# EAGLE design picnc (EAGLE 7.4.0)
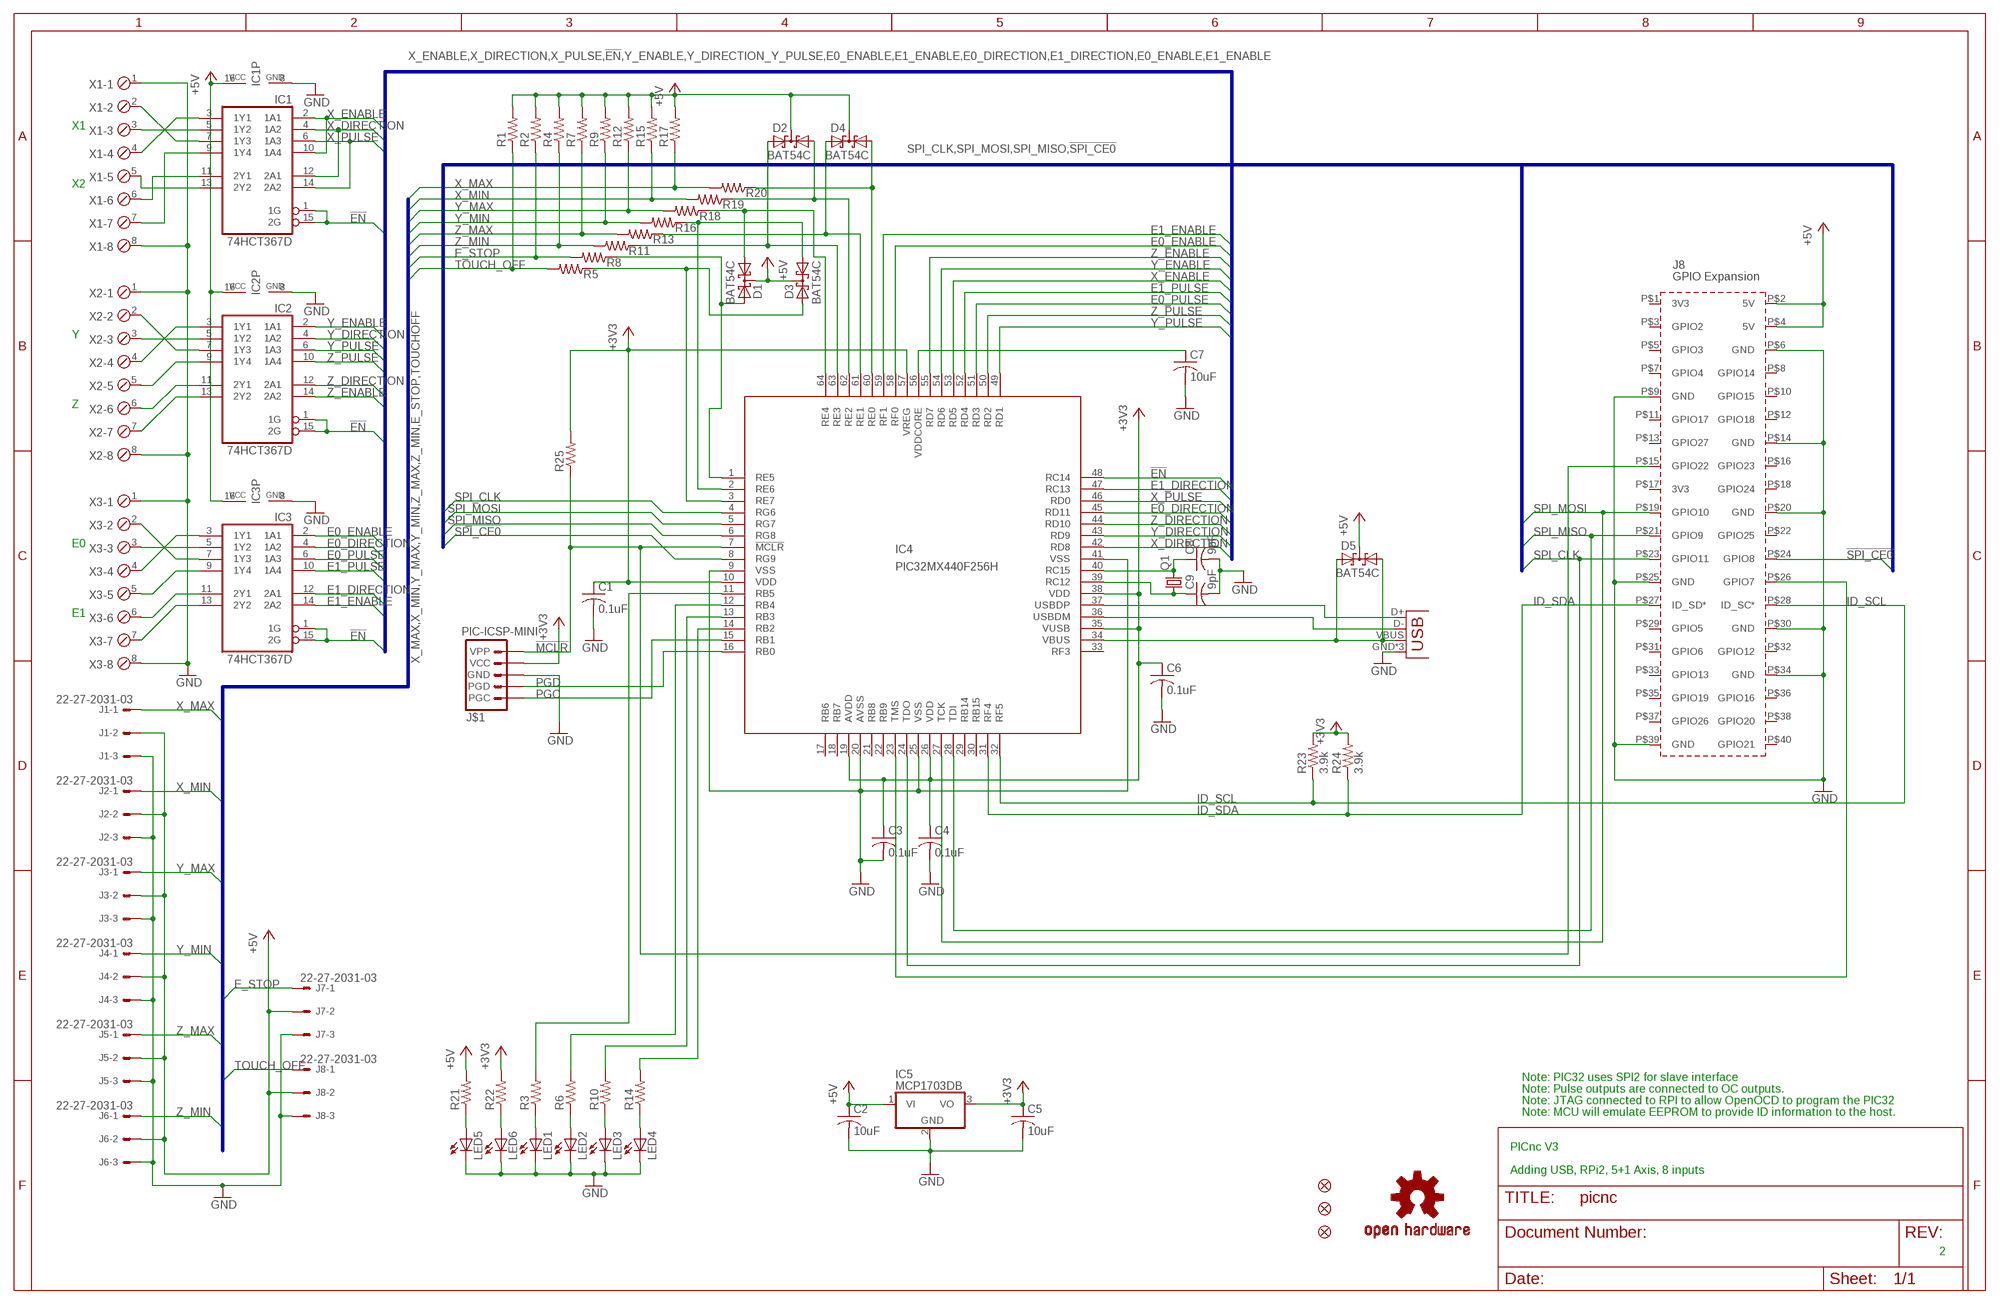
[diagram p0: schematic, sheet 1]

## Parts
C1  0.1uF  C-USC0603  [C0603]
C2  10uF  C-USC1206  [C1206]
C3  0.1uF  C-USC0603  [C0603]
C4  0.1uF  C-USC0603  [C0603]
C5  10uF  C-USC1206  [C1206]
C6  0.1uF  C-USC0603  [C0603]
C7  10uF  C-USC1206  [C1206]
C8  9pF  C-USC0603  [C0603]
C9  9pF  C-USC0603  [C0603]
D1  BAT54C  [SOT23]
D2  BAT54C  [SOT23]
D3  BAT54C  [SOT23]
D4  BAT54C  [SOT23]
D5  BAT54C  [SOT23]
FID1  FIDUCIAL1.5X3  [FIDUCIAL-1.5X3]
FID2  FIDUCIAL1.5X3  [FIDUCIAL-1.5X3]
FID3  FIDUCIAL1.5X3  [FIDUCIAL-1.5X3]
IC1  74HCT367D  [SO16]
IC2  74HCT367D  [SO16]
IC3  74HCT367D  [SO16]
IC4  PIC32MX440F256H  [TQFP64-10X10]
IC5  MCP1703DB  [SOT223]
J1  22-27-2031-03  [6410-03]
J2  22-27-2031-03  [6410-03]
J3  22-27-2031-03  [6410-03]
J4  22-27-2031-03  [6410-03]
J5  22-27-2031-03  [6410-03]
J6  22-27-2031-03  [6410-03]
J7  22-27-2031-03  [6410-03]
J8  22-27-2031-03  [6410-03]
J9  RPI2_HAT  [RPI2_HAT]
J$1  PIC-ICSP-MINI  [PIC-ICSP-MINI]
JP1  USB-MICROB  [USB-MICROB]
LED1  LEDCHIP-LED0603  [CHIP-LED0603]
LED2  LEDCHIP-LED0603  [CHIP-LED0603]
LED3  LEDCHIP-LED0603  [CHIP-LED0603]
LED4  LEDCHIP-LED0603  [CHIP-LED0603]
LED5  LEDCHIP-LED0603  [CHIP-LED0603]
LED6  LEDCHIP-LED0603  [CHIP-LED0603]
LOGO1  OSHW-LOGOS  [OSHW-LOGO-S]
Q1  CTS406C35D08M00000  CRYSTALCTS406  [CTS406]
R1  R-US_R0603  [R0603]
R2  R-US_R0603  [R0603]
R3  R-US_R0603  [R0603]
R4  R-US_R0603  [R0603]
R5  R-US_R0603  [R0603]
R6  R-US_R0603  [R0603]
R7  R-US_R0603  [R0603]
R8  R-US_R0603  [R0603]
R9  R-US_R0603  [R0603]
R10  R-US_R0603  [R0603]
R11  R-US_R0603  [R0603]
R12  R-US_R0603  [R0603]
R13  R-US_R0603  [R0603]
R14  R-US_R0603  [R0603]
R15  R-US_R0603  [R0603]
R16  R-US_R0603  [R0603]
R17  R-US_R0603  [R0603]
R18  R-US_R0603  [R0603]
R19  R-US_R0603  [R0603]
R20  R-US_R0603  [R0603]
R21  R-US_R0603  [R0603]
R22  R-US_R0603  [R0603]
R23  3.9k  R-US_R0603  [R0603]
R24  3.9k  R-US_R0603  [R0603]
R25  R-US_R0603  [R0603]
X1  MPT8  [8POL254]
X2  MPT8  [8POL254]
X3  MPT8  [8POL254]

## Nets
!EN: IC1.1(1G) IC1.15(2G) IC2.1(1G) IC2.15(2G) IC3.1(1G) IC3.15(2G) IC4.48(RC14)
!MCLR: IC4.7(!MCLR) J9.P$15(GPIO22) J$1.1(VPP) R25.1
!SPI_CE0: J9.P$24(GPIO8)
+3V3 [Power]: C1.1 C3.1 C4.1 C5.1 C6.1 IC4.10(VDD) IC4.19(AVDD) IC4.26(VDD) IC4.35(VUSB) IC4.38(VDD) IC4.57(VREG) IC5.3(VO) J$1.2(VCC) R22.2 R23.2 R24.2 R25.2
+5V [Power]: C2.1 D1.3(CC) D2.3(CC) D3.3(CC) D4.3(CC) D5.3(CC) IC1.16(VCC) IC2.16(VCC) IC3.16(VCC) IC5.1(VI) J1.2 J2.2 J3.2 J4.2 J5.2 J6.2 J7.2 J8.2 J9.P$2(5V) J9.P$4(5V) R1.2 R2.2 R4.2 R7.2 R9.2 R12.2 R15.2 R17.2 R21.2
D_N: IC4.36(USBDM) JP1.D-
D_P: IC4.37(USBDP) JP1.D+
E0_DIRECTION: IC3.4(1A2) IC4.45(RD11)
E0_ENABLE: IC3.2(1A1) IC4.58(RF0)
E0_PULSE: IC3.6(1A3) IC4.51(RD3)
E1_DIRECTION: IC3.12(2A1) IC4.47(RC13)
E1_ENABLE: IC3.14(2A2) IC4.59(RF1)
E1_PULSE: IC3.10(1A4) IC4.52(RD4)
E_STOP: J7.1 R2.1 R8.2
GND [Power]: C1.2 C2.2 C3.2 C4.2 C5.2 C6.2 C7.2 C8.2 C9.2 IC1.8(GND) IC2.8(GND) IC3.8(GND) IC4.9(VSS) IC4.20(AVSS) IC4.25(VSS) IC4.41(VSS) IC5.2(GND) J1.3 J2.3 J3.3 J4.3 J5.3 J6.3 J7.3 J8.3 J9.P$6(GND) J9.P$9(GND) J9.P$14(GND) J9.P$20(GND) J9.P$25(GND) J9.P$30(GND) J9.P$34(GND) J9.P$39(GND) J$1.3(GND) JP1.GND JP1.MT1(GND) JP1.MT2(GND) LED1.C LED2.C LED3.C LED4.C LED5.C LED6.C X1.1 X1.8 X2.1 X2.8 X3.1 X3.8
ID_SCL: IC4.32(RF5) J9.P$28(ID_SC*) R23.1
ID_SDA: IC4.31(RF4) J9.P$27(ID_SD*) R24.1
N$1: IC1.7(1Y3) X1.2
N$2: IC1.3(1Y1) X1.4
N$3: IC1.5(1Y2) X1.3
N$4: IC1.9(1Y4) X1.7
N$5: IC1.11(2Y1) X1.6
N$6: IC1.13(2Y2) X1.5
N$7: C8.1 IC4.40(RC15) Q1.3
N$8: IC2.5(1Y2) X2.3
N$9: C7.1 IC4.56(VDDCORE)
N$10: IC2.3(1Y1) X2.4
N$11: IC2.7(1Y3) X2.2
N$12: IC2.9(1Y4) X2.5
N$13: IC2.11(2Y1) X2.6
N$14: IC2.13(2Y2) X2.7
N$15: IC3.7(1Y3) X3.2
N$16: IC3.5(1Y2) X3.3
N$17: IC3.3(1Y1) X3.4
N$18: IC3.9(1Y4) X3.5
N$19: IC3.11(2Y1) X3.6
N$20: IC3.13(2Y2) X3.7
N$21: C9.1 IC4.39(RC12) Q1.1
N$22: LED1.A R3.1
N$23: LED2.A R6.1
N$24: LED3.A R10.1
N$25: LED4.A R14.1
N$26: D3.2(A2) IC4.3(RE7) R5.1
N$27: IC4.14(RB2) R14.2
N$28: IC4.13(RB3) R10.2
N$29: IC4.12(RB4) R6.2
N$30: IC4.11(RB5) R3.2
N$31: D4.1(A1) IC4.60(RE0) R20.1
N$32: D2.1(A1) IC4.62(RE2) R19.1
N$33 [Power]: D5.1(A1) D5.2(A2) IC4.34(VBUS) JP1.VBUS
N$34: D1.1(A1) IC4.64(RE4) R18.1
N$35: D4.2(A2) IC4.61(RE1) R13.1
N$36: D2.2(A2) IC4.63(RE3) R11.1
N$37: D1.2(A2) IC4.1(RE5) R8.1
N$38: D3.1(A1) IC4.2(RE6) R16.1
N$39: IC4.23(TMS) J9.P$26(GPIO7)
N$40: LED5.A R21.1
N$41: LED6.A R22.1
PGC: IC4.15(RB1) J$1.5(PGC)
PGD: IC4.16(RB0) J$1.4(PGD)
SPI_CLK: IC4.4(RG6) IC4.24(TDO) J9.P$23(GPIO11)
SPI_MISO: IC4.6(RG8) IC4.28(TDI) J9.P$21(GPIO9)
SPI_MOSI: IC4.5(RG7) IC4.27(TCK) J9.P$19(GPIO10)
TOUCH_OFF: J8.1 R1.1 R5.2
X_DIRECTION: IC1.4(1A2) IC1.12(2A1) IC4.42(RD8)
X_ENABLE: IC1.2(1A1) IC1.10(1A4) IC4.53(RD5)
X_MAX: J1.1 R17.1 R20.2
X_MIN: J2.1 R15.1 R19.2
X_PULSE: IC1.6(1A3) IC1.14(2A2) IC4.46(RD0)
Y_DIRECTION: IC2.4(1A2) IC4.43(RD9)
Y_ENABLE: IC2.2(1A1) IC4.54(RD6)
Y_MAX: J3.1 R12.1 R18.2
Y_MIN: J4.1 R9.1 R16.2
Y_PULSE: IC2.6(1A3) IC4.49(RD1)
Z_DIRECTION: IC2.12(2A1) IC4.44(RD10)
Z_ENABLE: IC2.14(2A2) IC4.55(RD7)
Z_MAX: J5.1 R7.1 R13.2
Z_MIN: J6.1 R4.1 R11.2
Z_PULSE: IC2.10(1A4) IC4.50(RD2)
Unconnected: IC4.8(RG9) IC4.17(RB6) IC4.18(RB7) IC4.21(RB8) IC4.22(RB9) IC4.29(RB14) IC4.30(RB15) IC4.33(RF3) J9.P$1(3V3) J9.P$3(GPIO2) J9.P$5(GPIO3) J9.P$7(GPIO4) J9.P$8(GPIO14) J9.P$10(GPIO15) J9.P$11(GPIO17) J9.P$12(GPIO18) J9.P$13(GPIO27) J9.P$16(GPIO23) J9.P$17(3V3) J9.P$18(GPIO24) J9.P$22(GPIO25) J9.P$29(GPIO5) J9.P$31(GPIO6) J9.P$32(GPIO12) J9.P$33(GPIO13) J9.P$35(GPIO19) J9.P$36(GPIO16) J9.P$37(GPIO26) J9.P$38(GPIO20) J9.P$40(GPIO21)

## Buses
SPI_CLK,SPI_MOSI,SPI_MISO,!SPI_CE0
X_ENABLE,X_DIRECTION,X_PULSE,!EN,Y_ENABLE,Y_DIRECTION_Y_PULSE,E0_ENABLE,E1_ENABLE,E0_DIRECTION,E1_DIRECTION,E0_ENABLE,E1_ENABLE
X_MAX,X_MIN,Y_MAX,Y_MIN,Z_MAX,Z_MIN,E_STOP,TOUCHOFF

## Notes on the sheet
- X1
- X2
- Y
- Z
- E0
- E1
- Note: PIC32 uses SPI2 for slave interface
- Note: Pulse outputs are connected to OC outputs.
- Note: JTAG connected to RPI to allow OpenOCD to program the PIC32
- Note: MCU will emulate EEPROM to provide ID information to the host.
- PICnc V3
- Adding USB, RPi2, 5+1 Axis, 8 inputs
- 2

## Library data of the parts
C1-C9 = rcl:C-US: CAPACITOR, American symbol
D1-D5 = diode:BAT54C: Schottky Diodes Source: Fairchild .. BAT54.pdf
FID1-FID3 = SparkFun-Aesthetics:FIDUCIAL: Fiducial Alignment Points Various fiducial points for machine vision alignment.
IC1-IC3 = 74xx-eu:74*367: Hex BUS DRIVER, 3-state
IC4 = microchip:PIC32MX440F256H: PIC32MX440F256H edit this description Auto generated by make-symbol-device-package-bsdl.ulp Rev. 25 Source: PIC32MX440F256H.bsdl; MPN: PIC32MX440F256H-80I/PT; OC_FARNELL: 1778947; OC_NEWARK: 98M1935
IC5 = linear:MCP1703: 250 mA, 16V, Low Quiescent Current LDO Regulator Source: http://ww1.microchip.com/downloads/en/DeviceDoc/22049b.pdf
J1-J8 = con-molex:22-?-03: CONNECTOR wire to board 2.54 mm (.1 inch) pitch header; OC_FARNELL: unknown; OC_NEWARK: unknown
J9 = e14_Rpi2_RevA:RPI2_HAT: Raspberry Pi 2 basic board outline and connector
J$1 = SparkFun-Connectors:PIC-ICSP-MINI: PIC-ICSP-Mini Miniature 5-pin connection for temporary programming of PICs. Use this device in your design to save space. Program the PIC with this adapter Spark Fun Electronics SKU : BOB-00194
JP1 = SparkFun-Connectors:USB: USB Connectors USB-B-PTH is fully proven SKU : PRT-00139/CONN-08278 USB-miniB is fully proven SKU : PRT-00587 USB-A-PCB is untested. USB-A-H is throughly reviewed, but untested. Spark Fun Electronics SKU : PRT-00437 USB-B-SMT is throughly reviewed, but untested. Needs silkscreen touching up. USB-A-S has not been used/tested USB-MB-H has not been used/tested USB-MICROB has been used. CONN-09505; PROD_ID: CONN-09505
LED1-LED6 = led:LED: LED OSRAM: - CHIPLED LG R971, LG N971, LY N971, LG Q971, LY Q971, LO R971, LY R971 LH N974, LH R974 LS Q976, LO Q976, LY Q976 LO Q996 - Hyper CHIPLED LW Q18S LB Q993, LB Q99A, LB R99A - SideLED LS A670, LO A670, LY A670, LG A670, LP A670 LB A673, LV A673, LT A673, LW A673 LH A674 LY A675 LS A676, LA A676, LO A676, LY A676, LW A676 LS A679, LY A679, LG A679 - Hyper Micro SIDELED® LS Y876, LA Y876, LO Y876, LY Y876 LT Y87S - SmartLED LW L88C, LW L88S LB L89C, LB L89S, LG L890 LS L89K, LO L89K, LY L89K LS L896, LA L896, LO L896, LY L896 - TOPLED LS T670, LO T670, LY T670, LG T670, LP T670 LSG T670, LSP T670, LSY T670, LOP T670, LYG T670 LG T671, LOG T671, LSG T671 LB T673, LV T673, LT T673, LW T673 LH T674 LS T676, LA T676, LO T676, LY T676, LB T676, LH T676, LSB T676, LW T676 LB T67C, LV T67C, LT T67C, LS T67K, LO T67K, LY T67K, LW E67C LS E67B, LA E67B, LO E67B, LY E67B, LB E67C, LV E67C, LT E67C LW T67C LS T679, LY T679, LG T679 LS T770, LO T770, LY T770, LG T770, LP T770 LB T773, LV T773, LT T773, LW T773 LH T774 LS E675, LA E675, LY E675, LS T675 LS T776, LA T776, LO T776, LY T776, LB T776 LHGB T686 LT T68C, LB T68C - Hyper Mini TOPLED® LB M676 - Mini TOPLED Santana® LG M470 LS M47K, LO M47K, LY M47K Source: http://www.osram.convergy.de LUXEON: - LUMILED® LXK2-PW12-R00, LXK2-PW12-S00, LXK2-PW14-U00, LXK2-PW14-V00 LXK2-PM12-R00, LXK2-PM12-S00, LXK2-PM14-U00 LXK2-PE12-Q00, LXK2-PE12-R00, LXK2-PE12-S00, LXK2-PE14-T00, LXK2-PE14-U00 LXK2-PB12-K00, LXK2-PB12-L00, LXK2-PB12-M00, LXK2-PB14-N00, LXK2-PB14-P00, LXK2-PB14-Q00 LXK2-PR12-L00, LXK2-PR12-M00, LXK2-PR14-Q00, LXK2-PR14-R00 LXK2-PD12-Q00, LXK2-PD12-R00, LXK2-PD12-S00 LXK2-PH12-R00, LXK2-PH12-S00 LXK2-PL12-P00, LXK2-PL12-Q00, LXK2-PL12-R00 Source: www.luxeon.com KINGBRIGHT: KA-3528ASYC Source: www.kingbright.com
LOGO1 = SparkFun-Aesthetics:OSHW-LOGO: Open Source Hardware Logo This logo indicates the piece of hardware it is found on incorporates a OSHW license and/or adheres to the definition of open source hardware found here: http://freedomdefined.org/OSHW
Q1 = crystal:CRYSTAL: CRYSTAL; OC_FARNELL: unknown; OC_NEWARK: unknown
R1-R25 = rcl:R-US_: RESISTOR, American symbol
X1-X3 = con-phoenix-254:MPT8: PHOENIX CONNECTOR; OC_FARNELL: unknown; OC_NEWARK: unknown

## Net classes
0 default: width 0.152 mm
1 Power: width 0.305 mm

## Board
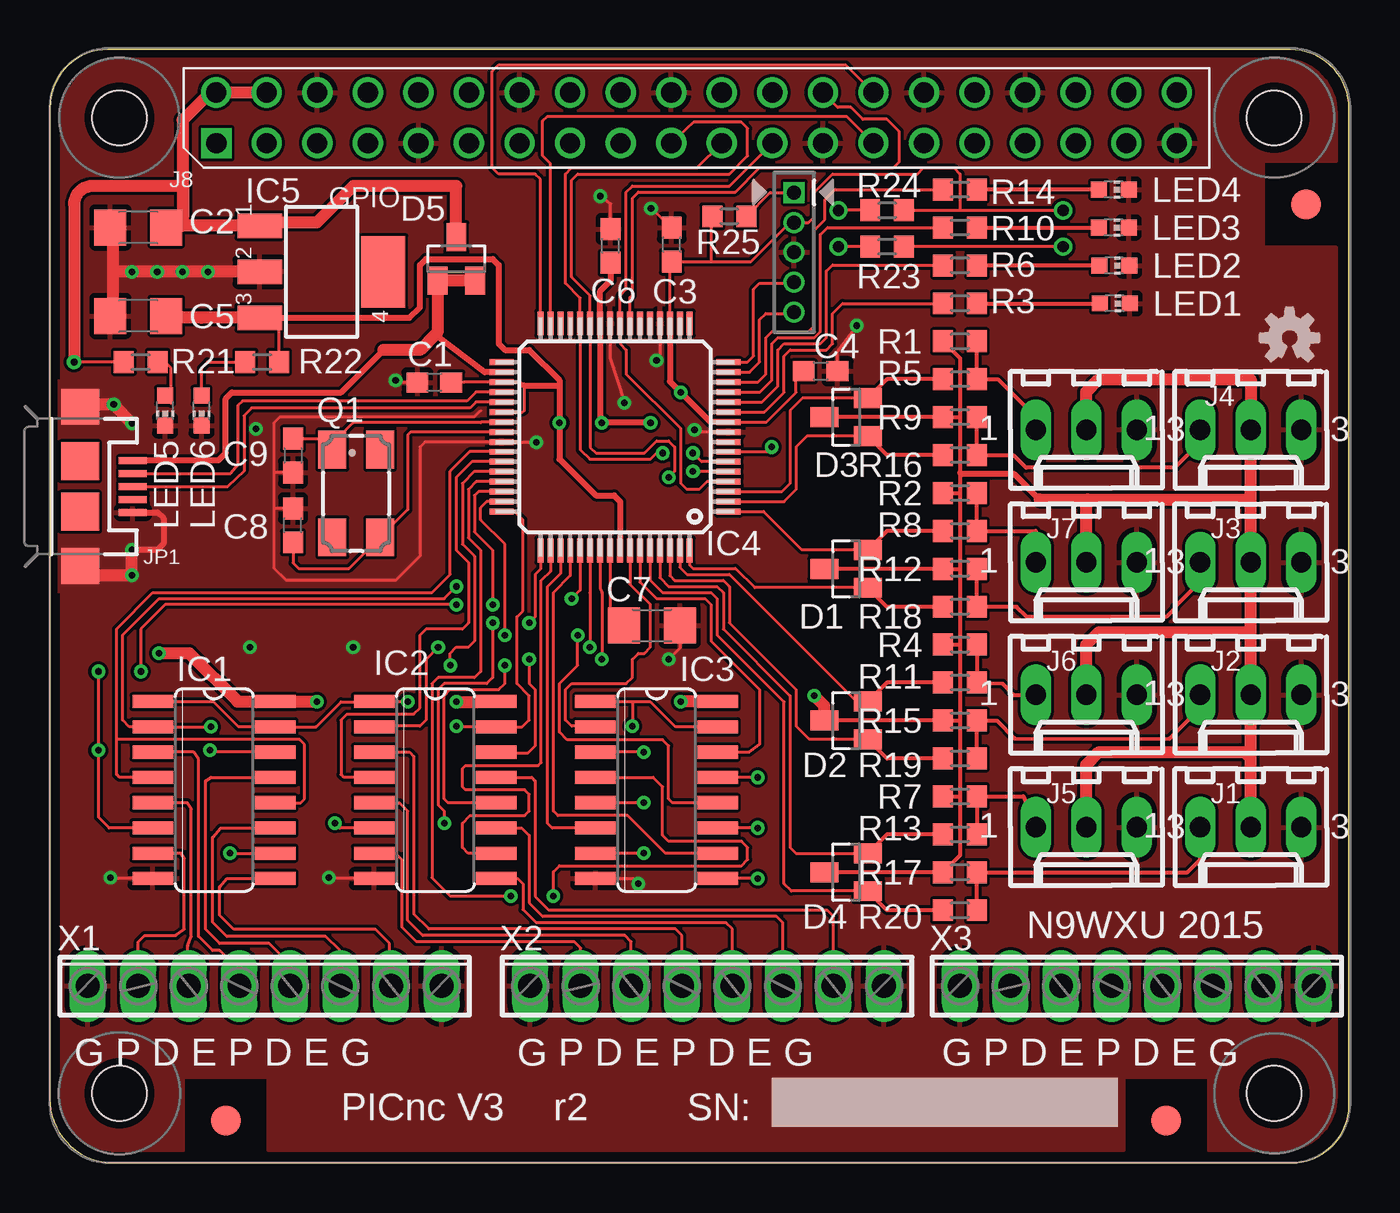
[diagram p1: board, top side]
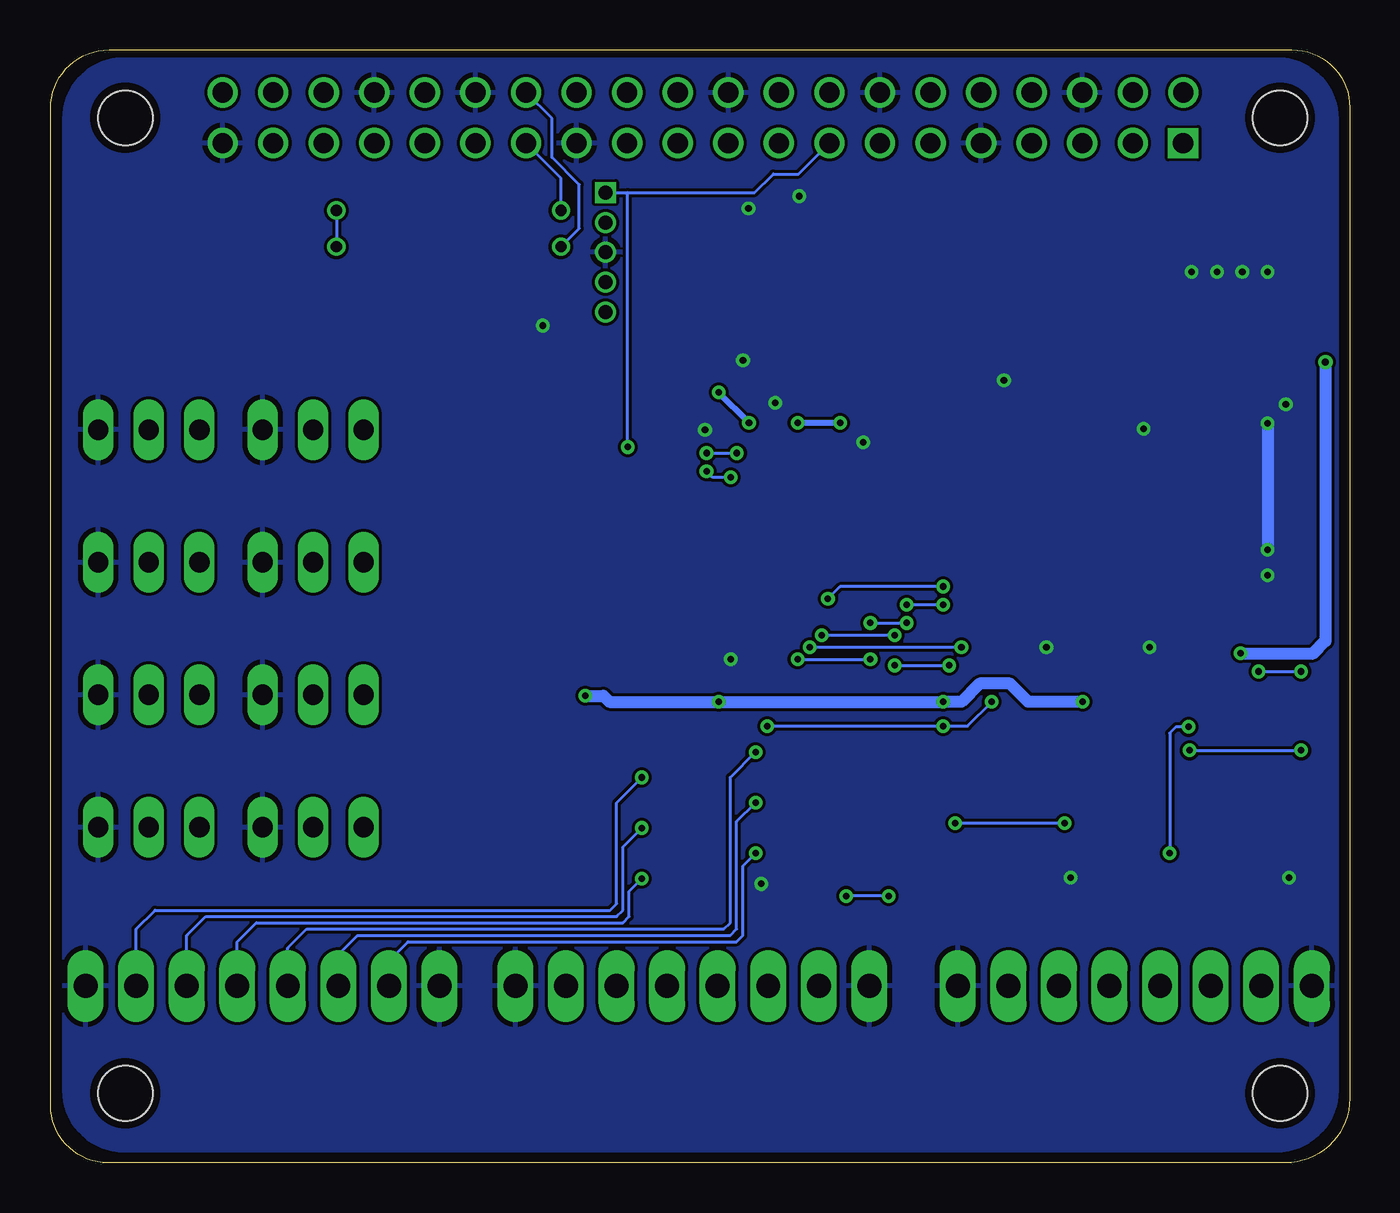
[diagram p2: board, bottom side, seen from below]

Size 65.25 x 55.92 mm. Coordinates in mm from the lower left corner, seen from the top.
Outline: 0,53.02 0,3.24 arc90 3.24,0 62.36,0 arc90 65.25,2.89 65.25,52.98 arc90 62.32,55.92 2.9,55.92 arc90 0,53.02
Copper layers (1*16): Top 0.0356mm / dielectric 1.5011mm / Bottom 0.0356mm
Design rules "LaenPCBOrder": minimum track width 6mil, minimum drill 13mil, track to track 6mil, track to pad 6mil, pad to pad 6mil, via to via 6mil, smd to smd 6mil, copper to edge 15mil, drill to drill 6mil, minimum pad ring 7mil, minimum via ring 7mil, stop-mask expansion 3mil, vias tented up to drill 0mil, thermal gap 10mil

### Footprints (pad centres in the part's own frame; a part is rotated, then mirrored left to right if it is on the bottom)
C0603 = smd 1.1 x 1: 1 -0.85,0; 2 0.85,0
C1206 = smd 1.6 x 1.8: 1 -1.4,0; 2 1.4,0
SOT23 = smd 1 x 1.4: 1 -0.95,-1.1; 2 0.95,-1.1; 3 0,1.1
FIDUCIAL-1.5X3 = smd 1.5 x 1.5: 1 0,0
SO16 = smd 0.66 x 2.032: 1 -4.445,-3.073; 2 -3.175,-3.073; 3 -1.905,-3.073; 4 -0.635,-3.073; 5 0.635,-3.073; 6 1.905,-3.073; 7 3.175,-3.073; 8 4.445,-3.073; 9 4.445,3.073; 10 3.175,3.073; 11 1.905,3.073; 12 0.635,3.073; 13 -0.635,3.073; 14 -1.905,3.073; 15 -3.175,3.073; 16 -4.445,3.073
TQFP64-10X10 = smd 1.2 x 0.3: 1 -5.7,3.75; 2 -5.7,3.25; 3 -5.7,2.75; 4 -5.7,2.25; 5 -5.7,1.75; 6 -5.7,1.25; 7 -5.7,0.75; 8 -5.7,0.25; 9 -5.7,-0.25; 10 -5.7,-0.75; 11 -5.7,-1.25; 12 -5.7,-1.75; 13 -5.7,-2.25; 14 -5.7,-2.75; 15 -5.7,-3.25; 16 -5.7,-3.75; 33 5.7,-3.75; 34 5.7,-3.25; 35 5.7,-2.75; 36 5.7,-2.25; 37 5.7,-1.75; 38 5.7,-1.25; 39 5.7,-0.75; 40 5.7,-0.25; 41 5.7,0.25; 42 5.7,0.75; 43 5.7,1.25; 44 5.7,1.75; 45 5.7,2.25; 46 5.7,2.75; 47 5.7,3.25; 48 5.7,3.75 | smd 0.3 x 1.2: 17 -3.75,-5.7; 18 -3.25,-5.7; 19 -2.75,-5.7; 20 -2.25,-5.7; 21 -1.75,-5.7; 22 -1.25,-5.7; 23 -0.75,-5.7; 24 -0.25,-5.7; 25 0.25,-5.7; 26 0.75,-5.7; 27 1.25,-5.7; 28 1.75,-5.7; 29 2.25,-5.7; 30 2.75,-5.7; 31 3.25,-5.7; 32 3.75,-5.7; 49 3.75,5.7; 50 3.25,5.7; 51 2.75,5.7; 52 2.25,5.7; 53 1.75,5.7; 54 1.25,5.7; 55 0.75,5.7; 56 0.25,5.7; 57 -0.25,5.7; 58 -0.75,5.7; 59 -1.25,5.7; 60 -1.75,5.7; 61 -2.25,5.7; 62 -2.75,5.7; 63 -3.25,5.7; 64 -3.75,5.7
SOT223 = smd 1.219 x 2.235: 1 -2.311,-3.099; 2 0,-3.099; 3 2.311,-3.099 | smd 3.6 x 2.2: 4 0,3.099
6410-03 = drill 1.016 long: 1 2.54,0; 2 0,0; 3 -2.54,0
RPI2_HAT = drill 1.016 square: P$1 8.37,51.23 | drill 1.016: P$2 8.357,53.772; P$3 10.897,51.232; P$4 10.897,53.772; P$5 13.437,51.232; P$6 13.437,53.772; P$7 15.977,51.232; P$8 15.977,53.772; P$9 18.517,51.232; P$10 18.517,53.772; P$11 21.057,51.232; P$12 21.057,53.772; P$13 23.597,51.232; P$14 23.597,53.772; P$15 26.137,51.232; P$16 26.137,53.772; P$17 28.677,51.232; P$18 28.677,53.772; P$19 31.217,51.232; P$20 31.217,53.772; P$21 33.757,51.232; P$22 33.757,53.772; P$23 36.297,51.232; P$24 36.297,53.772; P$25 38.837,51.232; P$26 38.837,53.772; P$27 41.377,51.232; P$28 41.377,53.772; P$29 43.917,51.232; P$30 43.917,53.772; P$31 46.457,51.232; P$32 46.457,53.772; P$33 48.997,51.232; P$34 48.997,53.772; P$35 51.537,51.232; P$36 51.537,53.772; P$37 54.077,51.232; P$38 54.077,53.772; P$39 56.617,51.232; P$40 56.617,53.772 | hole 2.75: 3.5,3.5; 61.5,3.5; 3.5,52.5; 61.5,52.5
PIC-ICSP-MINI = drill 0.7 square: 1 -3,0 | drill 0.7: 2 -1.5,0; 3 0,0; 4 1.5,0; 5 3,0
USB-MICROB = smd 0.35 x 1.4: D+ 0,2.65; D- -0.65,2.65; GND 1.3,2.65; ID 0.65,2.65; VBUS -1.3,2.65 | smd 1.8 x 1.9: MT1 -4,0; MT2 4,0 | smd 1.9 x 1.9: P$1 -1.27,0; P$2 1.27,0
CHIP-LED0603 = smd 0.8 x 0.8: A 0,-0.75; C 0,0.75
CTS406 = smd 1.9 x 1.4: 1 -2.2,-1.2; 2 2.2,-1.2; 3 2.2,1.2; 4 -2.2,1.2
R0603 = smd 1 x 1.1: 1 -0.85,0; 2 0.85,0
8POL254 = drill 1.2 long: 1 -8.89,0; 2 -6.35,0; 3 -3.81,0; 4 -1.27,0; 5 1.27,0; 6 3.81,0; 7 6.35,0; 8 8.89,0

### Placement (x,y rotation side)
C1  19.32,39.21 180 top
C2  4.45,46.99 180 top
C3  31.24,46.13 90 top
C4  38.72,39.78 0 top
C5  4.45,42.55 180 top
C6  28.17,46.07 90 top
C7  30.25,27 0 top
C8  12.22,32.03 90 top
C9  12.22,35.53 270 top
D1  40.01,29.84 90 top
D2  40.01,22.23 90 top
D3  40.01,37.47 90 top
D4  40.01,14.61 90 top
D5  20.42,45.42 0 top
FID1  63.09,48.16 0 top
FID2  56.08,2.13 0 top
FID3  8.84,2.13 0 top
IC1  8.26,18.73 270 top
IC2  19.37,18.73 270 top
IC3  30.48,18.73 270 top
IC4  28.4,36.47 180 top
IC5  13.65,44.77 270 top
J1  60.33,16.87 180 top
J2  60.33,23.52 180 top
J3  60.33,30.18 180 top
J4  60.33,36.83 180 top
J5  52.07,16.87 180 top
J6  52.07,23.52 180 top
J7  52.07,30.18 180 top
J8  52.07,36.83 180 top
J9  0,0 0 top
J$1  37.39,45.75 270 top
JP1  1.52,33.99 270 top
LED1  53.5,43.18 270 top
LED2  53.47,45.09 270 top
LED3  53.45,46.99 270 top
LED4  53.45,48.9 270 top
LED5  5.79,37.8 180 top
LED6  7.62,37.8 180 top
LOGO1  62.28,41.45 0 top
Q1  15.39,33.63 270 top
R1  45.72,41.27 180 top
R2  45.72,33.66 180 top
R3  45.72,43.18 180 top
R4  45.72,26.04 180 top
R5  45.72,39.37 0 top
R6  45.72,45.09 180 top
R7  45.72,18.41 180 top
R8  45.72,31.75 0 top
R9  45.72,37.47 180 top
R10  45.72,46.99 180 top
R11  45.72,24.13 0 top
R12  45.72,29.84 180 top
R13  45.72,16.51 0 top
R14  45.72,48.9 180 top
R15  45.72,22.23 180 top
R16  45.72,35.56 0 top
R17  45.72,14.61 180 top
R18  45.72,27.94 0 top
R19  45.72,20.32 0 top
R20  45.72,12.7 0 top
R21  4.57,40.23 180 top
R22  10.67,40.23 0 top
R23  42.06,46.02 0 top
R24  42.06,47.85 0 top
R25  34.14,47.55 180 top
X1  10.79,8.89 0 top
X2  33.02,8.89 0 top
X3  54.61,8.89 0 top

### Tracks (layer width: path | path; a pad name or v marks a point on that pad's centre or on a via)
!EN  (via drill 0.33)
  Top 0.152: IC1.1 8.22,23.18 9.49,21.91 IC1.15 13.37,21.91 14.63,23.16 16.28,23.16 IC2.1 16.31,23.16 v17.98,23.16 | IC3.15 31.43,21.91 30.18,23.16 27.42,23.16 IC3.1 29.26,23.18 v29.26,21.95 | IC4.48 23.36,32.72 23.77,32.31 23.77,27.74 23.47,27.43 23.47,24.08 24.08,23.47 24.08,22.25 23.74,21.91 IC2.15 20.46,21.91 v20.42,21.95
  Bottom 0.152: v17.98,23.16 19.2,21.95 v20.42,21.95 v29.26,21.95
!MCLR  (via drill 0.33)
  Top 0.152: IC4.7 36.03,35.72 v36.27,35.97 | R25.1 36.18,48.74 J$1.1
  Bottom 0.152: J$1.1 36.27,48.74 | 36.27,48.74 29.89,48.74 28.96,49.68 27.69,49.68 J9.P$15 | v36.27,35.97 36.27,48.74
+3V3  (via drill 0.33, 0.56)
  Top 0.152: C1.1 20.79,39.22 IC4.35 23.64,39.22 23.81,39.05 23.81,37.78 | IC4.38 23.75,37.72 23.81,37.78 | IC4.19 31.15,45.18 C3.1 33.22,45.28 | 33.22,45.28 35.22,45.28 37.19,47.24 J$1.2 38.1,47.24 38.41,47.55 38.41,48.77 39.32,49.68 43.59,49.68 43.89,49.99 45.41,49.99 45.72,49.68 45.72,47.85 | IC4.10 36.01,37.22 37.49,38.71 37.49,39.4 C4.1 | 23.82,37.8 23.81,37.78 | R22.2 11.52,42.61 11.28,42.37 7.62,42.46 | R24.2 45.72,47.85 | 45.72,47.85 v50.9,47.85 | v50.9,46.02 R23.2 | R25.2 33.22,47.48 33.22,45.28
  Top 0.305: IC5.3 18.07,42.46 18.59,42.98 18.59,45.11 18.9,45.41 22.25,45.41 22.55,45.11 22.55,41.15 22.86,40.84 24.08,40.84 25.6,39.32 25.6,39.01 | 25.6,39.01 v25.6,37.19 25.6,35.36 27.43,33.53 28.35,33.53 28.65,33.22 IC4.57 | 23.81,39.05 25.57,39.05 25.6,39.01 | IC4.10 33.18,37.22 v31.7,38.71 31.15,39.26 IC4.19 | v30.18,37.19 v27.74,37.19 27.65,37.27 IC4.26 27.65,43.8 28.18,44.33 C6.1
  Top 0.61: IC5.3 7.62,42.46 5.93,42.46 C5.1
  Bottom 0.152: v50.9,47.85 v50.9,46.02
  Bottom 0.305: v31.7,38.71 v30.18,37.19 | v27.74,37.19 v25.6,37.19
+5V  (via drill 0.33, 0.36)
  Top 0.152: R21.2 1.46,40.23 1.46,40.47 v1.22,40.23
  Top 0.203: D1.3 R12.2 45.72,29.84 | D3.3 R9.2 45.72,37.47 | D2.3 R15.2 45.72,22.23 | D4.3 R17.2 45.72,15.46 45.72,18.41 | R1.2 45.72,40.42 45.72,37.47 | 45.72,37.47 45.72,34.67 45.72,33.66 | 45.72,33.66 45.72,29.84 | 45.72,29.84 45.72,26.04 | 45.72,26.04 45.72,22.23 | 45.72,22.23 45.72,18.41 | R7.2 45.72,18.41 | R4.2 45.72,26.04 | R2.2 45.72,33.66
  Top 0.305: 49.72,33.34 48.46,34.59 45.8,34.59 45.72,34.67
  Top 0.61: J5.2 52.07,20 52.7,20.64 60.01,20.64 60.33,20.32 | J1.2 60.33,20.32 | 60.33,20.32 J2.2 60.33,26.67 | 60.33,26.67 J3.2 60.33,33.34 | 60.33,33.34 J4.2 60.33,39.37 52.7,39.37 52.07,38.73 J8.2 | 49.72,33.34 52.12,33.34 | 52.12,33.34 60.33,33.34 | J6.2 52.07,26.04 52.7,26.67 60.33,26.67 | J9.P$4 J9.P$2 8.05,53.77 6.67,52.39 6.67,47.55 | 6.67,47.08 IC5.1 10.72,47.24 13.41,47.24 15.24,49.07 20.42,49.07 D5.3 | 6.67,47.08 5.93,47.08 C2.1 | 6.67,47.55 6.67,47.08 | J7.2 52.07,33.29 52.12,33.34 | v5.49,25.6 7.01,25.6 9.44,23.18 IC1.16 13.41,23.18 v13.41,23.16 | v1.22,40.23 1.22,48.16 arc-90 2.13,49.07 6.71,49.07 6.71,47.59 6.67,47.55 | v20.42,23.16 22.43,23.16 IC2.16 | IC3.16 31.71,23.18 v31.7,23.16 | D2.3 38.91,22.97 v38.41,23.47
  Bottom 0.61: v5.49,25.6 1.83,25.6 1.22,26.21 v1.22,40.23 | v13.41,23.16 16.15,23.16 17.07,24.08 18.59,24.08 19.51,23.16 v20.42,23.16 v31.7,23.16 37.19,23.16 37.49,23.47 v38.41,23.47
D_N
  Top 0.152: IC4.36 21.4,38.72 20.96,38.28 9.68,38.28 9.45,38.05 9.45,35.05 9.08,34.63 JP1.D-
D_P
  Top 0.152: IC4.37 21.41,38.22 21.11,37.92 10.13,37.92 9.75,37.54 9.75,34.75 8.94,33.98 JP1.D+
E0_DIRECTION  (via drill 0.33)
  Top 0.152: IC4.45 21.42,34.22 21.03,33.83 21.03,31.39 21.64,30.79 21.64,24.69 21.34,24.38 19.51,24.38 19.2,24.08 19.2,14.33 20.12,13.41 v23.16,13.41 | v25.3,13.41 25.3,14.63 25.6,14.94 34.75,14.94 35.05,15.24 35.05,15.85 34.75,16.15 31.09,16.15 30.79,16.46 30.79,18.9 30.32,19.37 IC3.4
  Bottom 0.152: v23.16,13.41 v25.3,13.41
E0_ENABLE
  Top 0.152: IC4.58 29.15,29.07 30.18,28.04 30.18,25.91 29.87,25.6 29.57,25.6 29.26,25.3 29.26,24.38 28.96,24.08 26.21,24.08 25.91,23.77 25.91,22.25 26.21,21.95 27.45,21.95 IC3.2
E0_PULSE
  Top 0.152: IC3.6 25.23,16.83 24.99,17.07 24.99,28.96 25.65,29.61 IC4.51
E1_DIRECTION  (via drill 0.33)
  Top 0.152: v22.86,26.52 22.86,31.09 21.64,32.31 21.64,32.92 21.95,33.22 IC4.47 | IC3.12 31.28,18.1 31.09,18.29 31.09,20.95 30.79,21.26 25.98,21.26 25.6,21.64 25.6,24.08 26.52,24.99 v26.52,26.52
  Bottom 0.152: v26.52,26.52 v22.86,26.52
E1_ENABLE
  Top 0.152: IC4.59 29.65,29.18 30.48,28.35 32.92,28.35 33.22,28.04 33.22,26.21 35.66,23.77 35.66,21.03 35.14,20.64 IC3.14
E1_PULSE
  Top 0.152: IC3.10 30.92,15.56 29.03,17.45 25.53,17.45 25.3,17.68 25.3,28.65 26.15,29.5 IC4.52
E_STOP
  Top 0.203: J7.1 49.53,31.75 R8.2 R2.1
GND  (via drill 0.33)
  Top 0.152: v24.45,36.2 24.42,36.22 IC4.41 18.85,36.22 18.59,35.97 18.59,30.48 17.37,29.26 11.89,29.26 11.28,29.87 11.28,32.92 | IC4.25 28.15,40.43 v28.87,38.19 | IC4.20 30.65,40.49 v30.48,40.32 | IC4.9 32.49,36.72 v32.38,36.83 | C6.2 28.18,48.18 v27.65,48.56 | C3.2 31.11,47.1 v30.2,47.95 | 11.28,32.92 11.28,34.75 | 11.28,34.75 11.28,37.19 11.58,37.49 21.34,37.49 21.64,37.8 | C9.2 11.34,34.69 11.28,34.75 | C8.2 11.32,32.88 11.28,32.92 | C1.2 17.48,39.21 v17.37,39.32 | C4.2 39.57,40.79 v40.54,42.06 | IC1.8 3.09,14.29 v3.05,14.33 | IC2.8 14.06,14.29 v14.02,14.33 | IC3.8 29.3,14.29 v29.57,14.02 | C7.2 31.65,25.86 v31.09,25.3
  Top 0.305: JP1.GND 5.42,32.69 5.71,32.38 5.71,31.11 5.4,30.8 v4.13,30.8
  Top 0.61: IC5.2 v7.94,44.77 v6.67,44.77 v5.4,44.77 v4.13,44.77 3.17,44.77 | 3.17,44.77 3.17,46.86 C2.2 | C5.2 3.17,42.67 3.17,44.77 | JP1.MT1 1.79,37.98 1.92,38.11 v3.21,38.11 v4.13,37.15 | JP1.MT2 1.76,29.98 2.22,29.53 v4.13,29.53 v4.13,30.8
  Bottom 0.61: v4.13,37.15 v4.13,30.8
  other vias: 10.36,36.88 10.06,25.91 15.24,25.91
  pour Top: 3.66,55.47 61.87,55.47 arc-90 64.62,52.73 64.62,50.29 60.96,50.29 60.96,46.02 64.62,46.02 64.62,3.35 arc-90 61.87,0.61 58.22,0.61 58.22,4.27 53.95,4.27 53.95,0.61 10.97,0.61 10.97,4.27 6.71,4.27 6.71,0.61 3.35,0.61 arc-90 0.61,3.35 0.61,52.43 arc-90
  pour Bottom: 3.96,55.47 61.57,55.47 arc-90 64.62,52.43 64.62,49.68 64.62,3.66 arc-90 61.57,0.61 3.66,0.61 arc-90 0.61,3.66 0.61,52.43 arc-90 3.66,55.47
  pour Top (no thermals): 0.3,39.32 3.05,39.32 3.05,28.65 0.3,28.65
ID_SCL  (via drill 0.56)
  Top 0.152: IC4.32 24.65,49.41 24.38,49.68 22.55,49.68 22.23,50.01 22.23,54.84 22.55,55.17 39.98,55.17 J9.P$28 | R23.1 v39.62,46.02
  Bottom 0.152: v39.62,46.02 38.71,46.94 38.71,49.15 40.08,50.52 40.08,52.48 J9.P$28
ID_SDA  (via drill 0.56)
  Top 0.152: IC4.31 25.15,50.21 24.77,50.59 24.77,52.35 24.99,52.58 40.03,52.58 J9.P$27 | R24.1 v39.62,47.85
  Bottom 0.152: v39.62,47.85 39.62,49.48 J9.P$27
N$1
  Top 0.152: X1.2 4.45,11.11 4.76,11.43 6.34,11.43 6.76,11.73 6.76,15.29 6.59,15.56 IC1.7
N$2
  Top 0.152: X1.4 9.25,9.96 8.53,10.67 8.18,10.67 7.47,11.38 7.47,20.27 7.23,20.64 IC1.3
N$3
  Top 0.152: X1.3 6.93,10.9 7.11,11.38 7.11,17.78 6.91,18.1 IC1.5
N$4
  Top 0.152: X1.7 17.07,11.02 16.36,11.73 9.25,11.73 8.53,12.45 8.53,13.87 8.89,14.29 IC1.9
N$5
  Top 0.152: X1.6 14.58,10.67 13.87,11.38 8.89,11.38 8.18,12.09 8.18,16.36 8.57,16.83 IC1.11
N$6
  Top 0.152: X1.5 12.09,9.96 11.02,11.02 8.53,11.02 7.82,11.73 7.82,19.2 8.1,19.37 IC1.13
N$7
  Top 0.152: IC4.40 18.13,36.72 17.98,36.58 17.98,32.82 Q1.3 15.03,29.87 12.5,29.87 12.22,30.15 C8.1
N$8
  Top 0.152: X2.3 29.21,11.11 28.89,11.43 18.73,11.43 17.98,12.18 17.98,17.68 17.56,18.1 IC2.5
N$9
  Top 0.152: IC4.56 28.15,27.09 C7.1
N$10
  Top 0.152: X2.4 31.75,11.43 31.43,11.75 19.05,11.75 18.29,12.51 18.29,20.42 18.07,20.64 IC2.3
N$11
  Top 0.152: X2.2 26.67,10.79 26.35,11.11 18.41,11.11 17.68,11.85 17.68,15.24 17.36,15.56 IC2.7
N$12
  Top 0.152: X2.5 34.29,11.75 33.97,12.06 24.45,12.06 23.77,12.74 23.77,14.02 23.51,14.29 IC2.9
N$13
  Top 0.152: X2.6 36.83,12.06 36.51,12.38 24.77,12.38 24.08,13.07 24.08,16.46 23.71,16.83 IC2.11
N$14
  Top 0.152: X2.7 39.37,12.38 39.05,12.7 25.08,12.7 24.38,13.4 24.38,19.2 24.22,19.37 IC2.13
N$15  (via drill 0.33)
  Top 0.152: v29.84,15.56 IC3.7
  Bottom 0.152: X3.2 48.26,10.16 47.31,11.11 30.8,11.11 30.48,11.43 30.48,14.92 v29.84,15.56
N$16  (via drill 0.33)
  Top 0.152: v29.84,18.1 IC3.5
  Bottom 0.152: X3.3 50.8,10.48 49.85,11.43 31.11,11.43 30.8,11.75 30.8,17.14 v29.84,18.1
N$17  (via drill 0.33)
  Top 0.152: v29.84,20.64 IC3.3
  Bottom 0.152: X3.4 53.34,10.79 52.39,11.75 31.43,11.75 31.11,12.06 31.11,19.37 v29.84,20.64
N$18  (via drill 0.33)
  Top 0.152: v35.56,14.29 IC3.9
  Bottom 0.152: X3.5 55.88,11.11 54.93,12.06 36.51,12.06 36.2,12.38 36.2,13.65 v35.56,14.29
N$19  (via drill 0.33)
  Top 0.152: v35.56,16.83 IC3.11
  Bottom 0.152: X3.6 58.42,11.43 57.47,12.38 36.83,12.38 36.51,12.7 36.51,15.88 v35.56,16.83
N$20  (via drill 0.33)
  Top 0.152: v35.56,19.37 IC3.13
  Bottom 0.152: X3.7 60.96,11.75 60.01,12.7 37.15,12.7 36.83,13.02 36.83,18.1 v35.56,19.37
N$21
  Top 0.152: C9.1 13.64,36.38 Q1.1 14.33,35.96 14.33,36.27 15.24,37.19 21.64,37.19 21.68,37.22 IC4.39
N$22
  Top 0.203: R3.1 LED1.A
N$23
  Top 0.203: LED2.A R6.1
N$24
  Top 0.203: R10.1 LED3.A
N$25
  Top 0.203: LED4.A R14.1
N$26
  Top 0.152: D3.2 37.8,38.41 37.19,37.8 37.19,34.14 36.77,33.72 IC4.3
  Top 0.203: R5.1 42.06,39.37 D3.2
N$27
  Top 0.152: IC4.14 35.57,39.22 35.97,39.62 35.97,41.45 36.27,41.76 38.1,41.76 38.41,42.06 38.41,46.86 38.94,47.4 38.94,48.39 39.45,48.9 R14.2
N$28
  Top 0.152: IC4.13 35.68,38.72 36.27,39.32 36.27,41.15 36.58,41.45 38.41,41.45 38.71,41.76 38.71,46.63 39.06,46.99 R10.2
N$29
  Top 0.152: IC4.12 35.79,38.22 36.58,39.01 36.58,40.84 36.88,41.15 38.71,41.15 39.01,41.45 39.01,44.81 39.32,45.11 44.84,45.11 R6.2
N$30
  Top 0.152: IC4.11 35.9,37.72 36.88,38.71 36.88,40.54 37.19,40.84 39.01,40.84 39.32,41.15 39.32,42.67 39.83,43.18 R3.2
N$31
  Top 0.152: IC4.60 30.15,29.29 30.79,28.65 33.22,28.65 33.53,28.35 33.53,26.52 36.88,23.16 36.88,14.02 37.25,13.65 D4.1
  Top 0.203: R20.1 42.06,12.7 D4.1
N$32
  Top 0.152: IC4.62 31.15,29.51 31.39,29.26 33.83,29.26 34.14,28.96 34.14,27.13 37.49,23.77 37.49,21.95 38.16,21.27 D2.1
  Top 0.203: R19.1 42.06,20.32 D2.1
N$33
  Top 0.305: JP1.VBUS 8.46,35.28 8.84,35.66 8.84,38.41 9.14,38.71 14.63,38.71 16.76,40.84 | IC4.34 21.84,39.72 19.36,41.6
  Top 0.61: D5.2 D5.1 19.47,41.72 19.36,41.6 18.59,40.84 16.76,40.84
N$34
  Top 0.152: IC4.64 32.15,30.03 32.31,29.87 34.44,29.87 35.42,28.89 D1.1
  Top 0.203: R18.1 42.06,27.94 D1.1
N$35
  Top 0.152: IC4.61 30.65,29.4 31.09,28.96 33.53,28.96 33.83,28.65 33.83,26.82 37.19,23.47 37.19,15.85 37.49,15.54 41.09,15.54 D4.2
  Top 0.203: R13.1 42.06,16.51 D4.2
N$36
  Top 0.152: IC4.63 31.65,29.92 32,29.57 34.14,29.57 40.53,23.18 D2.2
  Top 0.203: R11.1 42.06,24.13 D2.2
N$37
  Top 0.152: IC4.1 35.86,32.72 37.78,30.8 D1.2
  Top 0.203: R8.1 42.06,31.75 D1.2
N$38
  Top 0.152: IC4.2 36.88,33.22 37.49,33.83 37.49,35.97 38.04,36.52 D3.1
  Top 0.203: R16.1 42.06,35.56 D3.1
N$39
  Top 0.152: IC4.23 29.15,43.47 29.26,43.59 29.26,48.46 29.57,48.77 34.44,48.77 35.66,49.99 42.37,49.99 42.67,50.29 42.67,51.82 42.06,52.43 40.84,52.43 40.23,53.03 39.57,53.03 J9.P$26
N$40
  Top 0.152: LED5.A 6.1,38.16 6.1,39.93 5.79,40.23 R21.1
N$41
  Top 0.152: LED6.A 7.62,39.93 7.92,40.23 R22.1
PGC
  Top 0.152: IC4.15 35.15,39.72 35.66,40.23 35.66,42.37 35.97,42.67 37.31,42.67 J$1.5
PGD
  Top 0.152: IC4.16 35.04,40.22 35.36,40.54 35.36,43.89 35.66,44.2 37.34,44.2 J$1.4
SPI_CLK
  Top 0.152: J9.P$23 34.14,49.07 29.26,49.07 28.96,48.77 28.96,43.89 28.65,43.58 IC4.24 28.65,41.15 28.96,40.84 28.96,39.62 31.7,36.88 31.7,34.14 32,33.83 32.61,33.83 33.01,34.22 IC4.4
SPI_MISO  (via drill 0.33)
  Top 0.152: J9.P$21 32.51,49.99 26.21,49.99 25.91,49.68 25.91,44.2 26.65,43.46 IC4.28 26.65,35.84 27.13,35.36 30.18,35.36 30.48,35.66 v30.79,35.66 | IC4.6 32.75,35.22 v32.31,35.66
  Bottom 0.152: v32.31,35.66 v30.79,35.66
SPI_MOSI  (via drill 0.33)
  Top 0.152: J9.P$19 32.33,52.27 34.75,52.27 35.05,51.97 35.05,50.6 34.14,49.68 26.52,49.68 26.21,49.38 26.21,44.5 27.15,43.57 IC4.27 27.15,35.95 27.43,35.66 29.87,35.66 30.48,36.27 31.09,36.27 31.39,35.97 31.39,34.75 v31.09,34.44 | v32.31,34.75 34.07,34.75 IC4.5
  Bottom 0.152: v31.09,34.44 32,34.44 v32.31,34.75
TOUCH_OFF
  Top 0.203: R1.1 R5.2 47.62,39.37 49.53,37.47 J8.1
X_DIRECTION
  Top 0.152: IC1.4 3.49,19.37 3.35,19.51 3.35,21.27 | 3.35,21.27 3.35,26.82 5.18,28.65 19.2,28.65 20.12,29.57 20.12,34.75 21.09,35.72 IC4.42 | IC1.12 12.61,18.1 12.8,18.29 12.8,21.01 12.54,21.27 3.35,21.27
X_ENABLE  (via drill 0.33)
  Top 0.152: v20.42,28.96 19.81,28.35 5.49,28.35 3.66,26.52 3.66,22.25 4,21.91 IC1.2 v8.1,21.91 | IC4.53 26.65,28.78 v26.21,28.35 | v9.05,15.56 IC1.10
  Bottom 0.152: v20.42,28.96 25.6,28.96 v26.21,28.35 | v8.1,21.91 8.73,21.91 9.05,21.59 v9.05,15.56
X_MAX
  Top 0.203: J1.1 57.78,15.24 57.15,14.61 R17.1 R20.2
X_MIN
  Top 0.203: R19.2 R15.1 47.57,22.23 48.46,21.34 56.24,21.31 57.78,22.86 J2.1
X_PULSE  (via drill 0.33)
  Top 0.152: IC1.14 8.13,20.64 v8.04,20.73 | IC1.6 2.98,16.83 2.44,17.37 v2.44,20.73 v2.44,24.69 | v22.25,28.04 22.25,30.79 21.34,31.7 21.34,33.53 21.53,33.72 IC4.46 | v20.42,28.04 5.79,28.04 4.57,26.82 v4.57,24.69
  Bottom 0.152: v8.04,20.73 v2.44,20.73 | v22.25,28.04 v20.42,28.04 | v4.57,24.69 v2.44,24.69
Y_DIRECTION
  Top 0.152: IC4.43 21.2,35.22 20.42,34.44 20.42,30.79 21.03,30.18 21.03,27.13 20.73,26.82 18.9,26.82 18.59,26.52 18.59,22.86 18.29,22.55 14.94,22.55 14.63,22.25 14.63,19.51 14.77,19.37 IC2.4
Y_ENABLE  (via drill 0.33)
  Top 0.152: v19.51,25.91 18.9,25.3 18.9,22.25 18.59,21.95 16.33,21.95 IC2.2 | IC4.54 27.15,28.98 27.13,28.65 v27.13,25.91
  Bottom 0.152: v27.13,25.91 v19.51,25.91
Y_MAX
  Top 0.203: R12.1 R18.2 48.56,27.94 49.07,27.43 56.08,27.43 56.52,27.86 56.52,27.94 57.78,29.21 J3.1
Y_MIN
  Top 0.203: R9.1 R16.2 48.4,35.56 49.03,34.92 56.52,34.92 57.78,36.2 J4.1
Y_PULSE  (via drill 0.33)
  Top 0.152: IC4.49 24.65,29.83 24.38,29.57 24.38,27.43 v24.08,27.13 | IC2.6 14.57,16.83 v14.33,17.07 | v22.25,27.13 22.25,24.38 21.95,24.08 19.81,24.08 19.51,23.77 19.51,17.98 19.81,17.68 v19.81,17.07
  Bottom 0.152: v14.33,17.07 v19.81,17.07 | v24.08,27.13 v22.25,27.13
Z_DIRECTION  (via drill 0.33)
  Top 0.152: IC2.12 20,18.1 19.81,18.29 19.81,23.47 20.12,23.77 22.55,23.77 22.86,24.08 v22.86,24.99 | v20.12,24.99 20.12,25.6 20.42,25.91 21.03,25.91 21.34,26.21 21.34,30.48 20.73,31.09 20.73,34.14 21.31,34.72 IC4.44
  Bottom 0.152: v22.86,24.99 v20.12,24.99
Z_ENABLE  (via drill 0.33)
  Top 0.152: v24.08,25.3 24.08,24.08 24.38,23.77 24.38,20.95 24,20.57 22.5,20.57 IC2.14 | IC4.55 27.65,28.87 27.74,28.65 v27.74,25.3
  Bottom 0.152: v27.74,25.3 v24.08,25.3
Z_MAX
  Top 0.203: J5.1 48.9,18.41 R7.1 R13.2
Z_MIN
  Top 0.203: R4.1 R11.2 47.85,24.08 48.41,23.52 J6.1
Z_PULSE
  Top 0.152: IC2.10 21.02,15.56 20.73,15.85 20.73,17.07 21.11,17.45 23.85,17.45 24.08,17.68 24.08,18.52 23.85,18.75 20.88,18.75 20.73,18.9 20.73,19.81 20.88,19.96 24.54,19.96 24.69,20.12 24.69,29.26 25.15,29.72 IC4.50

### Text on the board
tNames: N9WXU 2015 | G P D E P D E G | G P D E P D E G | G P D E P D E G | PICnc V3 | r2 | SN: